# EAGLE design mainbrd (EAGLE 9.6.2)
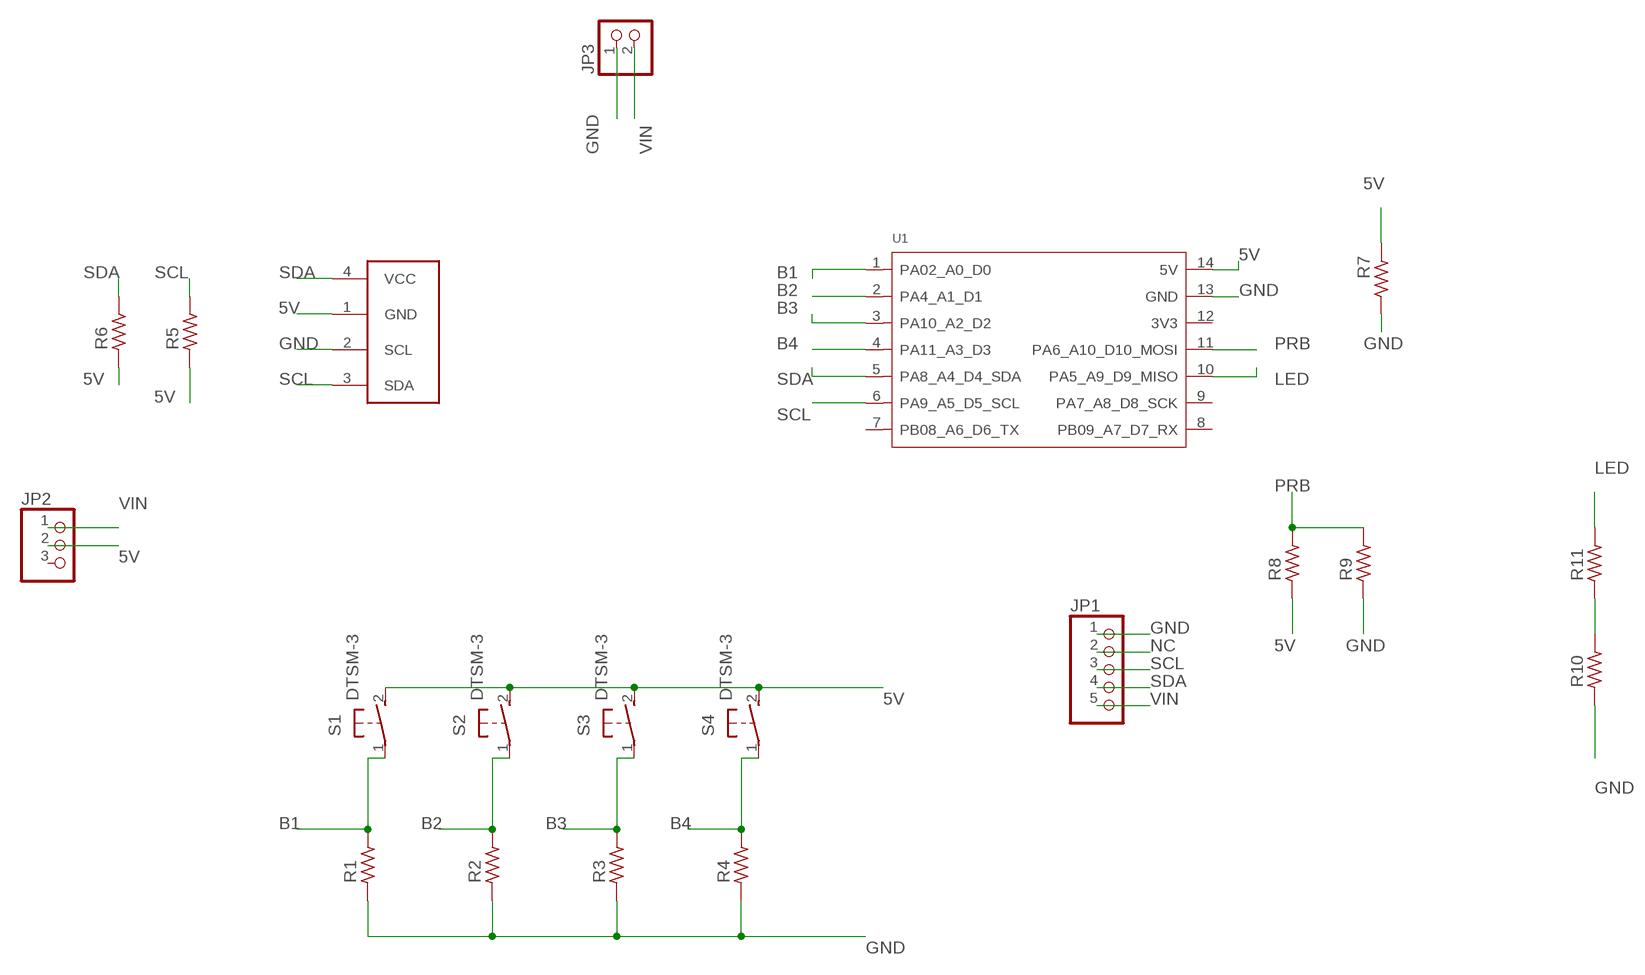
[diagram p0: schematic, sheet 1]

## Parts
JP1  PINHD-1X5  [1X05]
JP2  PINHD-1X3  [1X03]
JP3  PINHD-1X2  [1X02]
R1  R_1206  [R1206]
R2  R_1206  [R1206]
R3  R_1206  [R1206]
R4  R_1206  [R1206]
R5  R_1206  [R1206]
R6  R_1206  [R1206]
R7  R_1206  [R1206]
R8  R_1206  [R1206]
R9  R_1206  [R1206]
R10  R_1206  [R1206]
R11  R_1206  [R1206]
S1  DTSM-3  [DTSM-3]
S2  DTSM-3  [DTSM-3]
S3  DTSM-3  [DTSM-3]
S4  DTSM-3  [DTSM-3]
U1  MOUDLE-SEEEDUINO-XIAO  [MOUDLE14P-2.54-21X17.8MM]
U$1  I2C_OLED  [I2C_OLED_PACKAGE]

## Nets
5V: JP2.2 R5.1 R6.1 R7.2 R8.1 S1.2 S2.2 S3.2 S4.2 U1.14(5V) U$1.1(GND)
B1: R1.2 S1.1 U1.1(PA02_A0_D0)
B2: R2.2 S2.1 U1.2(PA4_A1_D1)
B3: R3.2 S3.1 U1.3(PA10_A2_D2)
B4: R4.2 S4.1 U1.4(PA11_A3_D3)
GND: JP1.1 JP3.1 R1.1 R2.1 R3.1 R4.1 R7.1 R9.1 R10.1 U1.13(GND) U$1.2(SCL)
LED: R11.2 U1.10(PA5_A9_D9_MISO)
N$1: R10.2 R11.1
NC: JP1.2
PRB: R8.2 R9.2 U1.11(PA6_A10_D10_MOSI)
SCL: JP1.3 R5.2 U1.6(PA9_A5_D5_SCL) U$1.3(SDA)
SDA: JP1.4 R6.2 U1.5(PA8_A4_D4_SDA) U$1.4(VCC)
VIN: JP1.5 JP2.1 JP3.2
Unconnected: JP2.3 U1.7(PB08_A6_D6_TX) U1.8(PB09_A7_D7_RX) U1.9(PA7_A8_D8_SCK) U1.12(3V3)

## Library data of the parts
JP1 = pinhead:PINHD-1X5: PIN HEADER
JP2 = pinhead:PINHD-1X3: PIN HEADER
JP3 = pinhead:PINHD-1X2: PIN HEADER
R1-R11 = rc-master-smd:R_: RESISTOR
S1-S4 = switch-tact:DTSM-3
U1 = Seeeduino XIAO:MOUDLE-SEEEDUINO-XIAO
U$1 = OLEDi2c:I2C_OLED

## Board
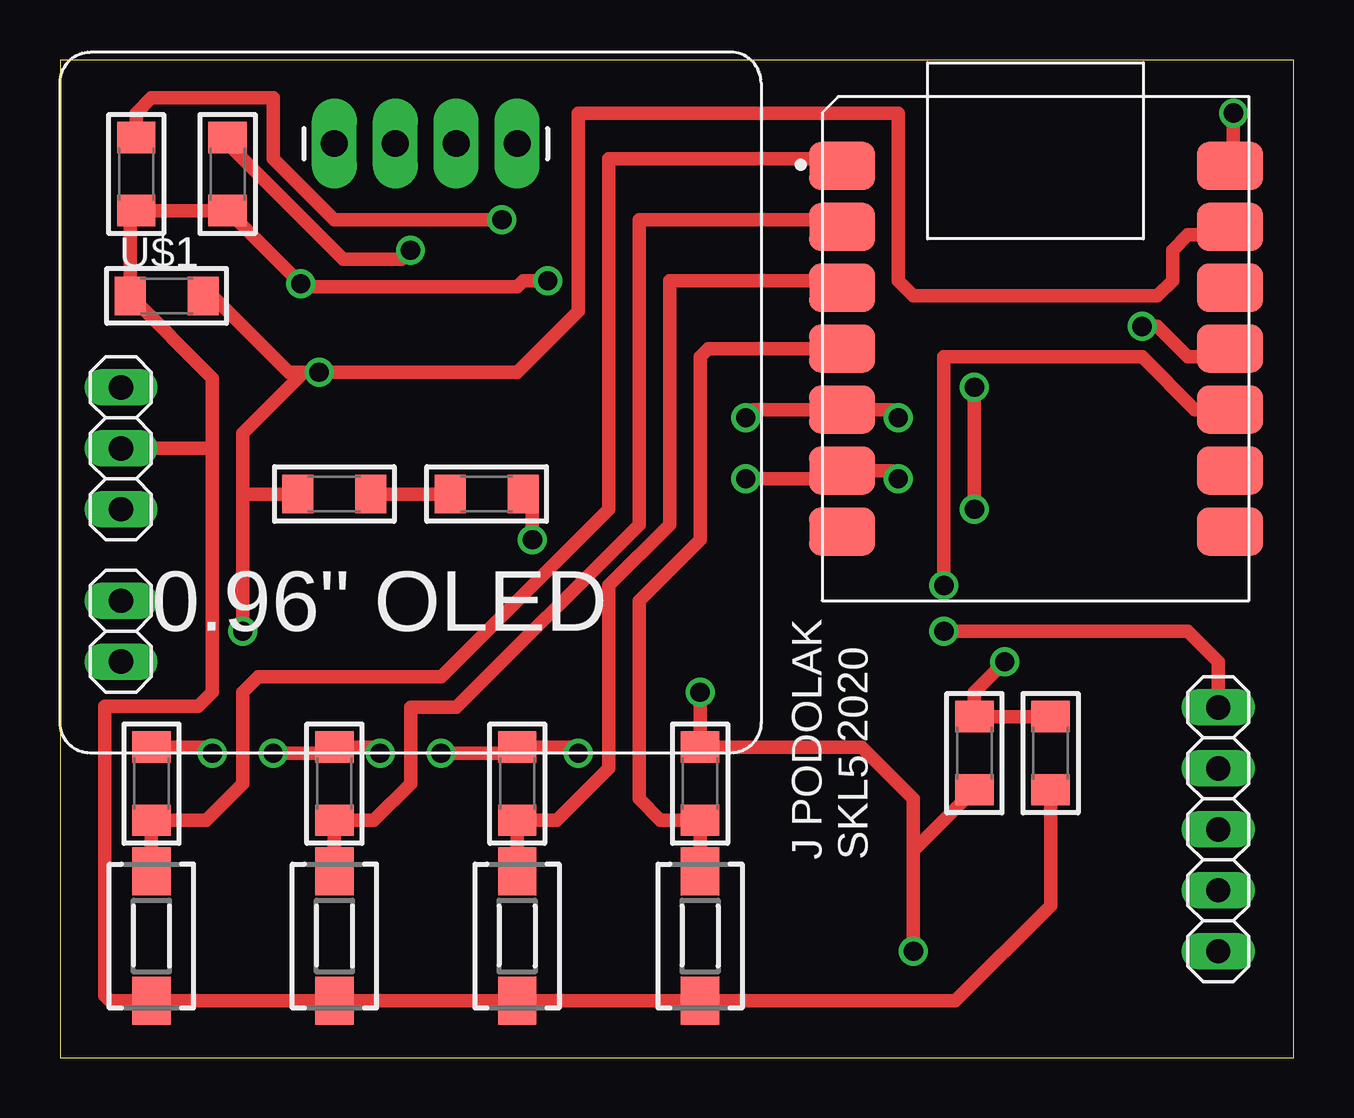
[diagram p1: board, top side]
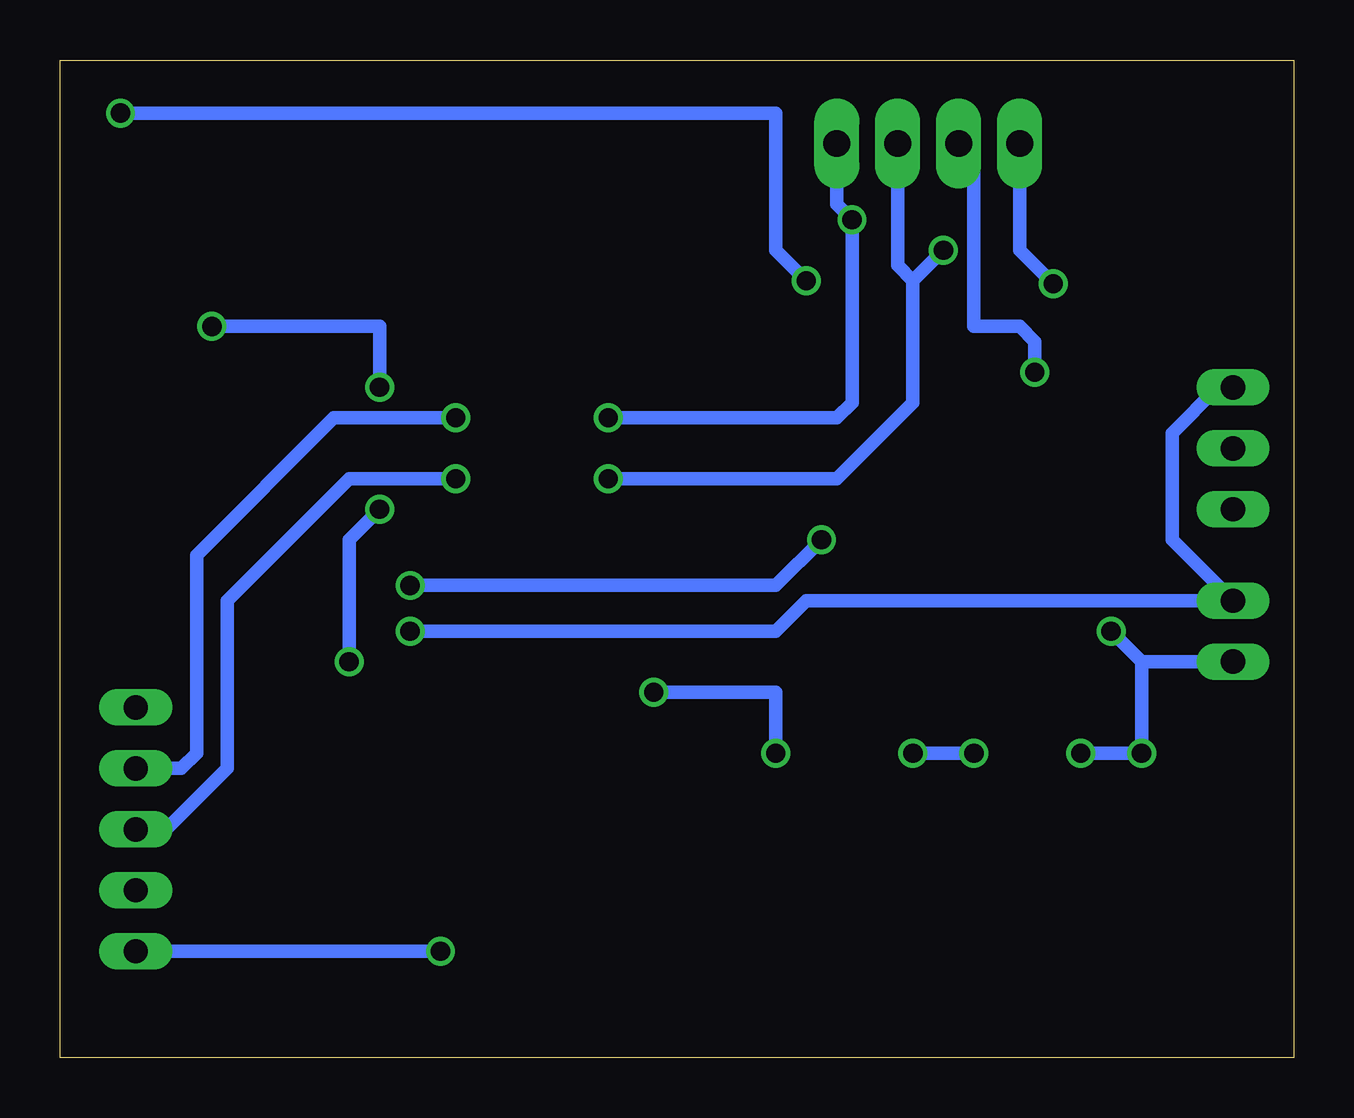
[diagram p2: board, bottom side, seen from below]

Size 51.41 x 41.58 mm. Coordinates in mm from the lower left corner, seen from the top.
Outline: 0,0 51.41,0 51.41,41.58 0,41.58 0,0
Copper layers (1*16): Top 0.035mm / dielectric 1.5mm / Bottom 0.035mm
Design rules "default": minimum track width 6mil, minimum drill 0.35mm, track to track 6mil, track to pad 6mil, pad to pad 6mil, via to via 6mil, smd to smd 6mil, copper to edge 40mil, drill to drill 6mil, minimum pad ring 10mil, minimum via ring 8mil, stop-mask expansion 4mil, vias tented up to drill 0mil, thermal gap 10mil

### Footprints (pad centres in the part's own frame; a part is rotated, then mirrored left to right if it is on the bottom)
1X05 = drill 1.016 long: 1 -5.08,0; 2 -2.54,0; 3 0,0; 4 2.54,0; 5 5.08,0
1X03 = drill 1.016 long: 1 -2.54,0; 2 0,0; 3 2.54,0
1X02 = drill 1.016 long: 1 -1.27,0; 2 1.27,0
R1206 = smd 1.3 x 1.6: 1 -1.524,0; 2 1.524,0
DTSM-3 = smd 2 x 1.6: 1 -2.7,0; 2 2.7,0
MOUDLE14P-2.54-21X17.8MM = smd 2.75 x 2: 1 0.835,18.12; 2 0.835,15.58; 3 0.835,13.04; 4 0.835,10.5; 5 0.835,7.96; 6 0.835,5.42; 7 0.835,2.88; 8 17,2.88; 9 17,5.42; 10 17,7.96; 11 17,10.5; 12 17,13.04; 13 17,15.58; 14 17,18.12
I2C_OLED_PACKAGE = drill 1.118 pad 1.88 long: 1 0,0; 2 2.54,0; 3 5.08,0; 4 7.62,0

### Placement (x,y rotation side)
JP1  48.26,9.53 90 top
JP2  2.54,25.4 270 top
JP3  2.54,17.78 90 top
R1  3.81,11.43 270 top
R2  11.43,11.43 270 top
R3  19.05,11.43 270 top
R4  26.67,11.43 270 top
R5  6.99,36.83 90 top
R6  3.17,36.83 90 top
R7  4.45,31.75 180 top
R8  41.27,12.7 90 top
R9  38.1,12.7 90 top
R10  11.43,23.5 0 top
R11  17.78,23.5 0 top
S1  3.81,5.08 270 top
S2  11.43,5.08 270 top
S3  19.05,5.08 270 top
S4  26.67,5.08 270 top
U1  31.75,19.05 0 top
U$1  11.43,38.1 0 top

### Tracks (layer width: path | path; a pad name or v marks a point on that pad's centre or on a via)
5V  (via drill 0.8)
  Top 0.559: v48.9,39.37 48.9,37.31 U1.14 | R8.1 41.27,6.35 37.3,2.38 S4.2 S3.2 S2.2 S1.2 2.07,2.38 1.85,2.59 1.85,14.66 5.77,14.66 6.35,15.24 6.35,25.4 | 3.81,25.4 JP2.2 6.35,25.4 | 6.35,25.4 6.35,28.32 R7.2 2.92,35.05 R6.1 R5.1 v10.03,32.26 10.16,32.13 19.05,32.13 19.3,32.38 v20.32,32.38
  Bottom 0.559: v48.9,39.37 21.59,39.37 21.59,33.66 v20.32,32.38 | U$1.1 11.43,33.66 v10.03,32.26
B1
  Top 0.559: S1.1 R1.2 6.1,9.91 7.62,11.43 7.62,15.24 8.25,15.88 15.88,15.88 22.86,22.86 22.86,37.47 23.5,37.47 32.29,37.47 U1.1
B2
  Top 0.559: S2.1 R2.2 13.08,9.91 14.61,11.43 14.61,14.61 16.51,14.61 24.13,22.23 24.13,34.92 32.29,34.92 U1.2
B3
  Top 0.559: S3.1 R3.2 20.7,9.91 22.86,12.06 22.86,19.68 25.4,22.23 25.4,32.38 32.29,32.38 U1.3
B4
  Top 0.559: S4.1 R4.2 25.02,9.91 24.13,10.79 24.13,19.05 26.67,21.59 26.67,29.21 27.01,29.55 U1.4
GND  (via drill 0.8)
  Top 0.559: v35.56,4.45 35.56,8.64 | 35.56,8.64 R9.1 | 35.56,8.64 35.56,10.79 33.4,12.95 R4.1 v26.67,15.24 | R1.1 6.1,12.95 v6.35,12.7 | v8.89,12.7 11.18,12.7 R2.1 13.08,12.95 v13.34,12.7 | v15.88,12.7 18.8,12.7 R3.1 21.34,12.95 v21.59,12.7 | v7.62,17.78 7.62,23.5 | 7.62,23.5 R10.1 | 7.62,23.5 7.62,26.04 10.16,28.57 | 10.16,28.57 9.52,28.57 6.35,31.75 R7.1 | 10.16,28.57 v10.8,28.57 19.05,28.57 21.59,31.11 21.59,39.37 34.93,39.37 34.93,32.38 35.56,31.75 45.72,31.75 46.36,32.38 46.36,33.66 46.99,34.29 48.41,34.29 U1.13
  Bottom 0.559: JP1.1 v35.56,4.45 | v8.89,12.7 v6.35,12.7 6.35,16.51 | v13.34,12.7 v15.88,12.7 | v21.59,12.7 21.59,15.24 v26.67,15.24 | JP3.1 6.35,16.51 | 6.35,16.51 v7.62,17.78 | v10.8,28.57 10.8,29.84 11.43,30.48 13.34,30.48 13.34,37.47 U$1.2
LED  (via drill 0.8)
  Top 0.559: R11.2 19.69,23.11 v19.69,21.59 | v36.83,19.68 36.83,29.21 45.09,29.21 47.29,27.01 U1.10
  Bottom 0.559: v19.69,21.59 21.59,19.68 v36.83,19.68
N$1
  Top 0.559: R11.1 R10.2
PRB  (via drill 0.8)
  Top 0.559: R8.2 R9.2 38.1,15.24 v39.37,16.51 | v38.1,22.86 v38.1,27.94 | v45.09,30.48 45.72,30.48 46.99,29.21 48.41,29.21 U1.11
  Bottom 0.559: v39.37,16.51 39.37,21.59 v38.1,22.86 | v38.1,27.94 38.1,30.48 v45.09,30.48
SCL  (via drill 0.8)
  Top 0.559: v28.57,24.13 32.24,24.13 U1.6 34.59,24.47 v34.93,24.13 | R5.2 6.99,38.1 11.81,33.27 14.22,33.27 v14.61,33.66
  Bottom 0.559: 15.88,32.38 15.88,27.3 19.05,24.13 v28.57,24.13 | v34.93,24.13 39.37,24.13 44.45,19.05 44.45,12.06 46.99,9.53 JP1.3 | v14.61,33.66 15.88,32.38 | 15.88,32.38 16.51,33.02 U$1.3
SDA  (via drill 0.8)
  Top 0.559: v28.57,26.67 28.91,27.01 U1.5 34.59,27.01 v34.93,26.67 | R6.2 3.17,39.37 3.81,40.01 8.89,40.01 8.89,37.47 11.43,34.92 v18.41,34.92
  Bottom 0.559: v28.57,26.67 19.05,26.67 18.41,27.3 v18.41,34.92 19.05,35.56 U$1.4 | JP1.4 46.36,12.06 45.72,12.7 45.72,20.95 40.01,26.67 v34.93,26.67
VIN  (via drill 0.8)
  Top 0.559: v36.83,17.78 46.99,17.78 48.26,16.51 JP1.5
  Bottom 0.559: JP2.1 3.17,27.94 5.08,26.04 5.08,21.59 JP3.2 20.32,19.05 21.59,17.78 v36.83,17.78

### Text on the board
tNames: J PODOLAK / SKL5 2020